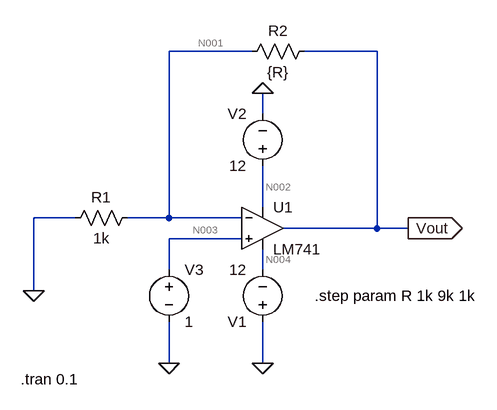
[diagram p0: schematic Draft1.asc]
Draft1.asc, the LTspice schematic file:
Version 4
SHEET 1 880 680
WIRE 224 -176 96 -176
WIRE 416 -176 304 -176
WIRE 240 -80 240 -112
WIRE 240 64 240 0
WIRE -48 80 -112 80
WIRE 96 80 96 -176
WIRE 96 80 32 80
WIRE 208 80 96 80
WIRE 416 96 416 -176
WIRE 416 96 272 96
WIRE 464 96 416 96
WIRE 208 112 96 112
WIRE 96 160 96 112
WIRE 240 160 240 128
WIRE -112 192 -112 80
WIRE 96 304 96 240
WIRE 240 304 240 240
FLAG 96 304 0
FLAG 240 304 0
FLAG -112 192 0
FLAG 240 -112 0
FLAG 464 96 Vout
IOPIN 464 96 Out
SYMBOL OpAmps\\LM741 240 32 R0
SYMATTR InstName U1
SYMBOL res 48 64 R90
WINDOW 0 0 56 VBottom 2
WINDOW 3 32 56 VTop 2
SYMATTR InstName R1
SYMATTR Value 1k
SYMBOL voltage 240 256 R180
WINDOW 123 0 0 Left 0
WINDOW 39 0 0 Left 0
SYMATTR InstName V1
SYMATTR Value 12
SYMBOL voltage 240 16 R180
WINDOW 0 24 96 Left 2
WINDOW 3 24 16 Left 2
WINDOW 123 0 0 Left 0
WINDOW 39 0 0 Left 0
SYMATTR InstName V2
SYMATTR Value 12
SYMBOL voltage 96 144 R0
WINDOW 123 0 0 Left 0
WINDOW 39 0 0 Left 0
SYMATTR InstName V3
SYMATTR Value 1
SYMBOL res 320 -192 R90
WINDOW 0 0 56 VBottom 2
WINDOW 3 32 56 VTop 2
SYMATTR InstName R2
SYMATTR Value {R}
TEXT 320 200 Left 2 !.step param R 1k 9k 1k
TEXT -132 328 Left 2 !.tran 0.1

The netlist it stands for:
* Draft1.asc
XU1 N003 N001 N002 N004 Vout LM741  ; pins In+ In- V+ V- OUT
R1 N001 0 1k
V1 0 N004 12
V2 N002 0 12
V3 N003 0 1
R2 Vout N001 {R}
.step param R 1k 9k 1k
.tran 0.1
.lib LM741.lib
.backanno
.end

* Results of the author's LTspice run, read from the files saved beside the schematic
* Operating Point (first step), zero values left out:
*   r = 1 k
*   V(n001) = 1.001 V
*   V(n003) = 1 V
*   V(n004) = -12 V
*   V(n002) = 12 V
*   V(vout) = 2.002 V
*   I(R2) = 1.001 mA
*   I(R1) = 1.001 mA
*   I(V3) = -57.84 nA
*   I(V2) = -2.553 mA
*   I(V1) = -1.553 mA
*   Ix(u1:1) = 57.84 nA
*   Ix(u1:2) = 101.9 nA
*   Ix(u1:99) = 2.553 mA
*   Ix(u1:50) = -1.553 mA
*   Ix(u1:28) = -1.001 mA
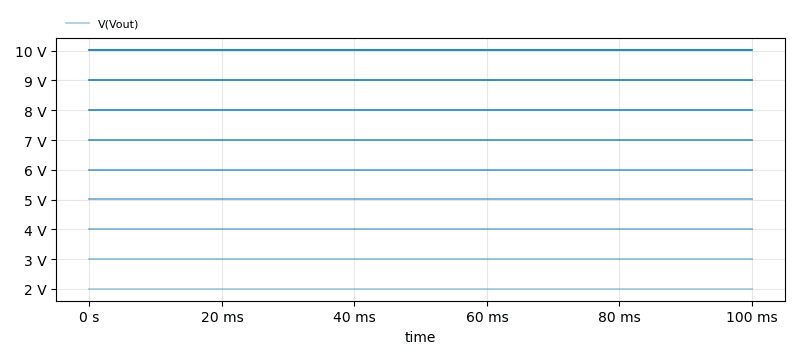
[diagram p1: Transient Analysis of Draft1.asc, plotted from the saved traces]
* Transient Analysis, 9 runs:
*   V(Vout) [r=1000]: min 2.002 V, max 2.002 V, average 2.002 V, rms 2.002 V, last 2.002 V
*   V(Vout) [r=2000]: min 3.003 V, max 3.003 V, average 3.003 V, rms 3.003 V, last 3.003 V
*   V(Vout) [r=3000]: min 4.004 V, max 4.004 V, average 4.004 V, rms 4.004 V, last 4.004 V
*   V(Vout) [r=4000]: min 5.005 V, max 5.005 V, average 5.005 V, rms 5.005 V, last 5.005 V
*   V(Vout) [r=5000]: min 6.007 V, max 6.007 V, average 6.007 V, rms 6.007 V, last 6.007 V
*   V(Vout) [r=6000]: min 7.008 V, max 7.008 V, average 7.008 V, rms 7.008 V, last 7.008 V
*   V(Vout) [r=7000]: min 8.009 V, max 8.009 V, average 8.009 V, rms 8.009 V, last 8.009 V
*   V(Vout) [r=8000]: min 9.01 V, max 9.01 V, average 9.01 V, rms 9.01 V, last 9.01 V